# EAGLE design Trig to Gate Converter ctrl V1 (EAGLE 7.7.0)
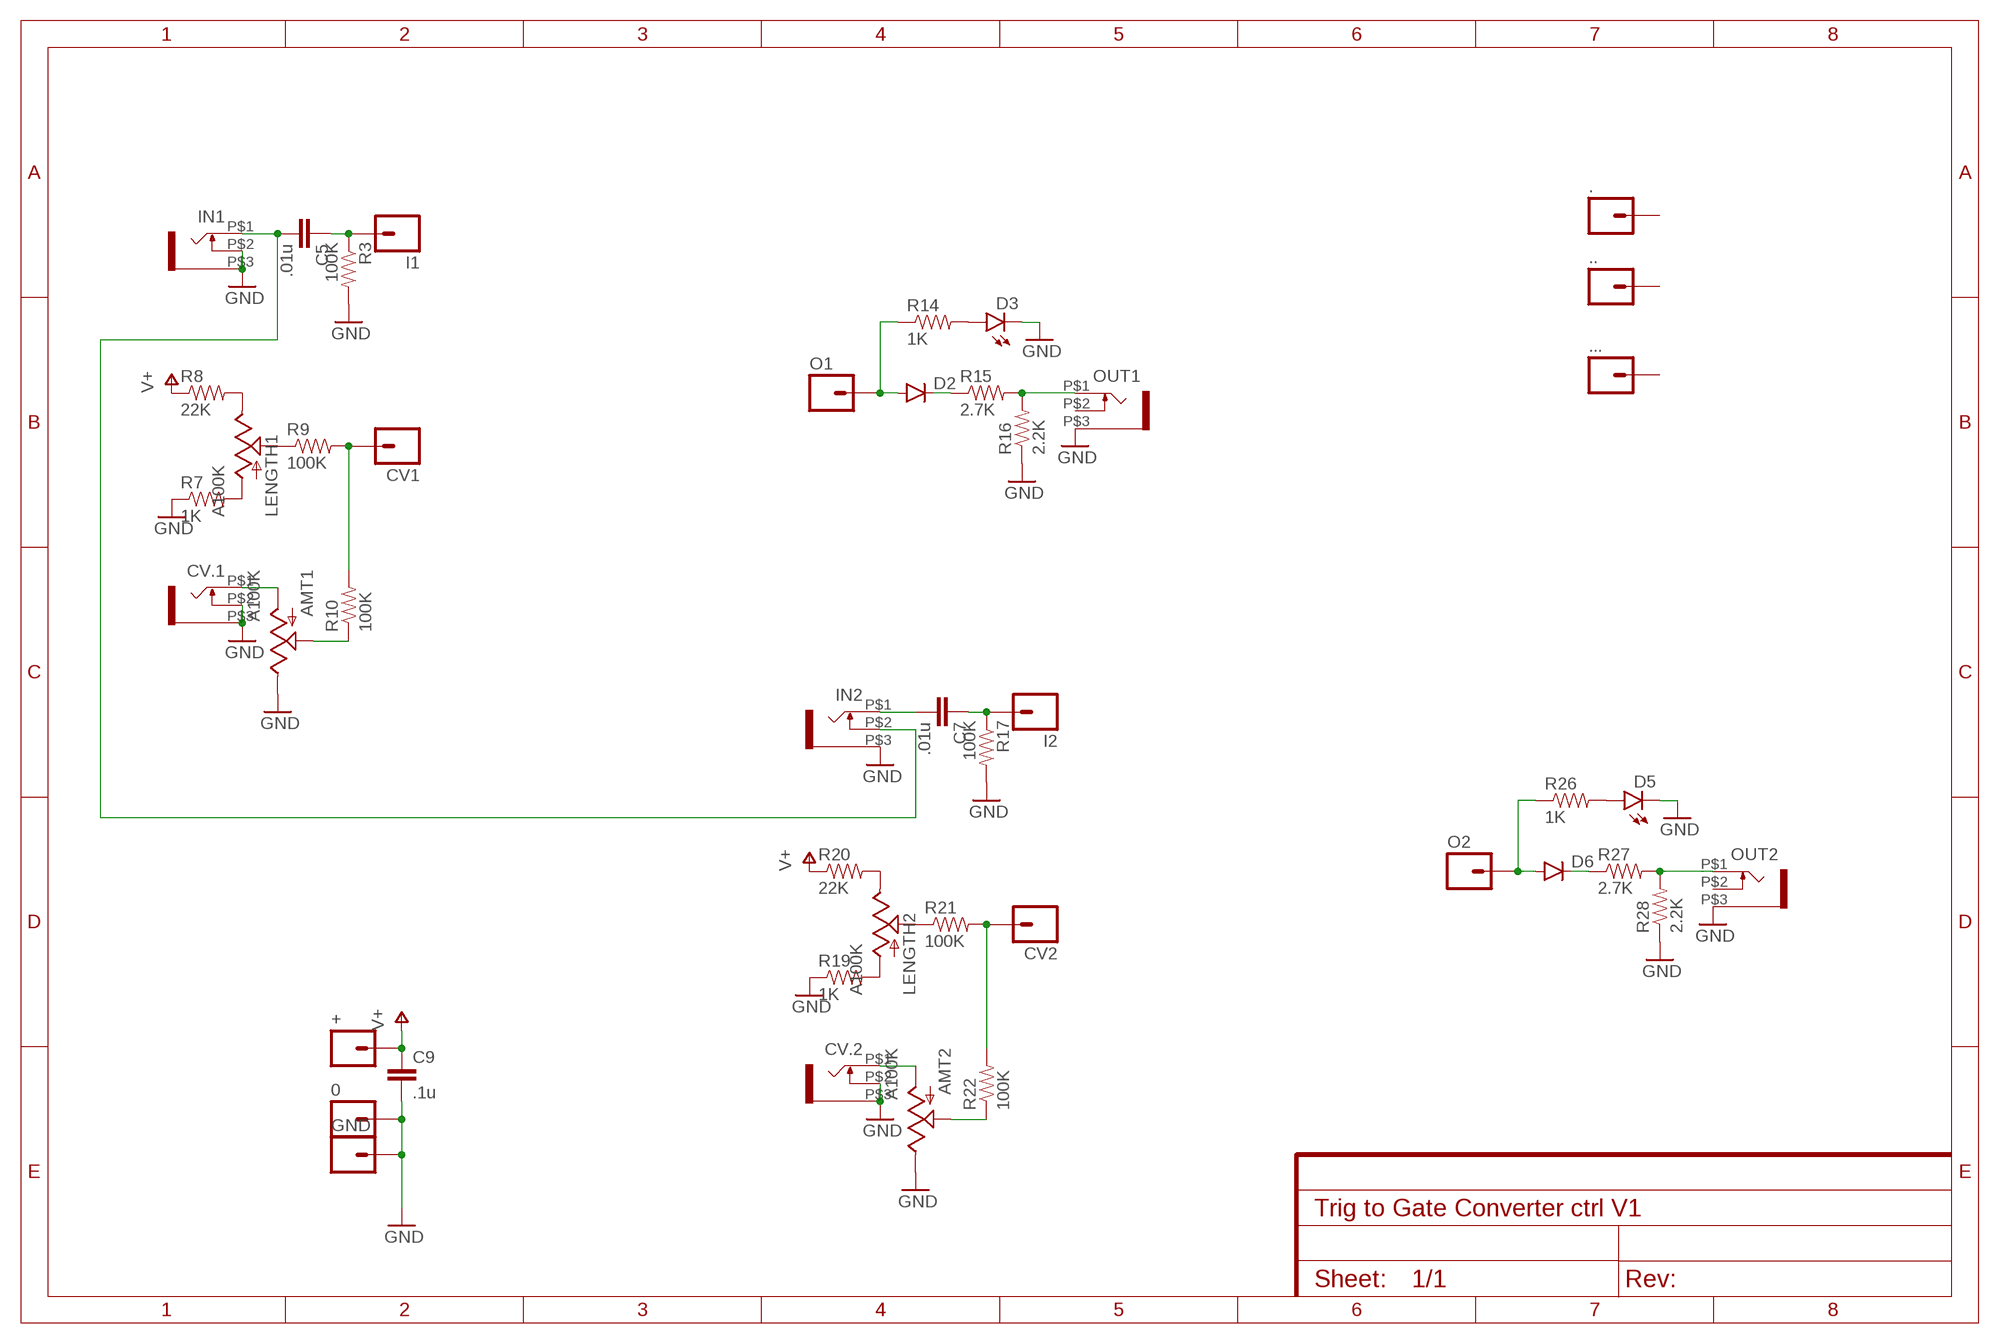
[diagram p0: schematic, sheet 1]

## Parts
0  M01PTH  [1X01]
+  M01PTH  [1X01]
.  M01PTH  [1X01]
..  M01PTH  [1X01]
...  M01PTH  [1X01]
AMT1  A100K  POT  [ALPS_POT]
AMT2  A100K  POT  [ALPS_POT]
C5  .01u  CAP0805  [0805]
C7  .01u  CAP0805  [0805]
C9  .1u  CAP0805  [0805]
CV1  M01PTH  [1X01]
CV2  M01PTH  [1X01]
CV.1  WQP-PJ301M-12_JACK  [WQP-PJ301M-12_JACK]
CV.2  WQP-PJ301M-12_JACK  [WQP-PJ301M-12_JACK]
D2  DIODESOD123  [SOD-123]
D3  LED3MM  [LED3MM]
D5  LED3MM  [LED3MM]
D6  DIODESOD123  [SOD-123]
GND  M01PTH  [1X01]
I1  M01PTH  [1X01]
I2  M01PTH  [1X01]
IN1  WQP-PJ301M-12_JACK  [WQP-PJ301M-12_JACK]
IN2  WQP-PJ301M-12_JACK  [WQP-PJ301M-12_JACK]
LENGTH1  A100K  POT  [ALPS_POT]
LENGTH2  A100K  POT  [ALPS_POT]
O1  M01PTH  [1X01]
O2  M01PTH  [1X01]
OUT1  WQP-PJ301M-12_JACK  [WQP-PJ301M-12_JACK]
OUT2  WQP-PJ301M-12_JACK  [WQP-PJ301M-12_JACK]
R3  100K  RESISTOR0805-RES  [0805]
R7  1K  RESISTOR0805-RES  [0805]
R8  22K  RESISTOR0805-RES  [0805]
R9  100K  RESISTOR0805-RES  [0805]
R10  100K  RESISTOR0805-RES  [0805]
R14  1K  RESISTOR0805-RES  [0805]
R15  2.7K  RESISTOR0805-RES  [0805]
R16  2.2K  RESISTOR0805-RES  [0805]
R17  100K  RESISTOR0805-RES  [0805]
R19  1K  RESISTOR0805-RES  [0805]
R20  22K  RESISTOR0805-RES  [0805]
R21  100K  RESISTOR0805-RES  [0805]
R22  100K  RESISTOR0805-RES  [0805]
R26  1K  RESISTOR0805-RES  [0805]
R27  2.7K  RESISTOR0805-RES  [0805]
R28  2.2K  RESISTOR0805-RES  [0805]

## Nets
GND: 0.1 AMT1.P$1(E) AMT2.P$1(E) C9.2 CV.1.P$2 CV.1.P$3 CV.2.P$2 CV.2.P$3 D3.K(C) D5.K(C) GND.1 IN1.P$2 IN1.P$3 IN2.P$3 OUT1.P$3 OUT2.P$3 R3.2 R7.1 R16.1 R17.2 R19.1 R28.1
N$2: LENGTH2.P$1(E) R20.2
N$4: LENGTH1.P$3(A) R7.2
N$5: LENGTH1.P$1(E) R8.2
N$6: LENGTH1.P$2(S) R9.1
N$7: AMT1.P$3(A) CV.1.P$1
N$8: AMT1.P$2(S) R10.1
N$9: CV1.1 R9.2 R10.2
N$10: C5.2 IN1.P$1 IN2.P$2
N$11: C5.1 I1.1 R3.1
N$14: D3.A R14.2
N$18: OUT1.P$1 R15.2 R16.2
N$19: D2.C R15.1
N$20: D2.A O1.1 R14.1
N$23: LENGTH2.P$3(A) R19.2
N$24: LENGTH2.P$2(S) R21.1
N$25: AMT2.P$3(A) CV.2.P$1
N$26: AMT2.P$2(S) R22.1
N$27: CV2.1 R21.2 R22.2
N$28: C7.2 IN2.P$1
N$29: C7.1 I2.1 R17.1
N$35: D5.A R26.2
N$36: OUT2.P$1 R27.2 R28.2
N$37: D6.C R27.1
N$38: D6.A O2.1 R26.1
V+: +.1 C9.1 R8.1 R20.1
Unconnected: ..1 ...1 ....1 OUT1.P$2 OUT2.P$2

## Library data of the parts
0 + . .. ... CV1 CV2 GND I1 I2 O1 O2 = SparkFun-Connectors:M01: Header 1 Standard 1-pin 0.1" header. Use with straight break away headers (SKU : PRT-00116), right angle break away headers (PRT-00553), swiss pins (PRT-00743), machine pins (PRT-00117), and female headers (PRT-00115).
AMT1 AMT2 LENGTH1 LENGTH2 = SparkFun-Electromechanical:POT; PROD_ID: RES-09177
C5 C7 C9 = SparkFun-Capacitors:CAP: Capacitor Standard 0603 ceramic capacitor, and 0.1" leaded capacitor.
CV.1 CV.2 IN1 IN2 OUT1 OUT2 = thonkiconn:WQP-PJ301M-12_JACK
D2 D6 = SparkFun-DiscreteSemi:DIODE: Diode These are standard reverse protection diodes and small signal diodes. SMA package can handle up to about 1A. SOD-323 can handle about 200mA. What the SOD-323 package when ordering, there are some mfgs out there that are 5-pin packages.
D3 D5 = SparkFun-LED:LED: LEDs Standard schematic elements and footprints for 5mm, 3mm, 1206, and 0603 sized LEDs. 5mm - Spark Fun Electronics SKU : COM-00529 (and others)
R3 R7-R10 R14-R17 R19-R22 R26-R28 = SparkFun-Resistors:RESISTOR: Resistor Basic schematic elements and footprints for 0603, 1206, and PTH resistors.

## Board
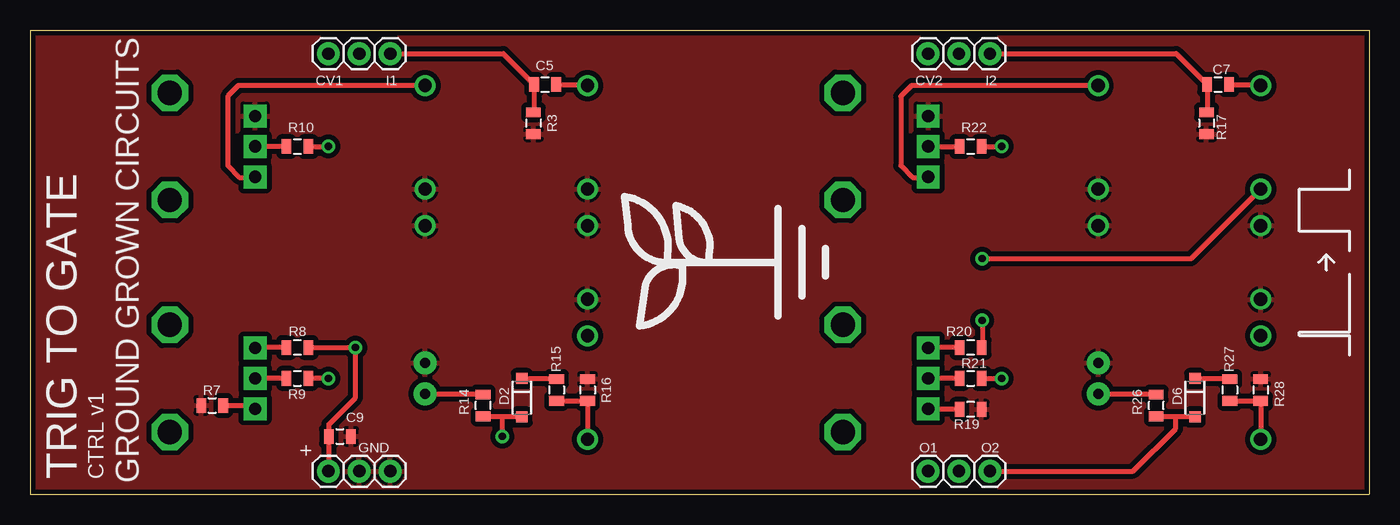
[diagram p1: board, top side]
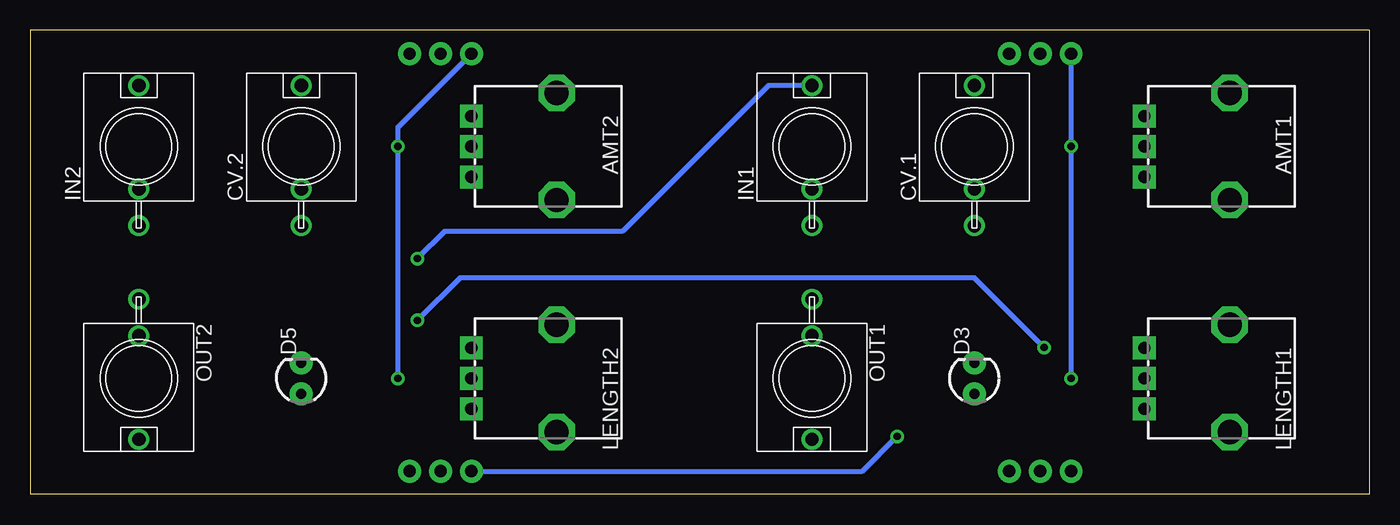
[diagram p2: board, bottom side, seen from below]

Size 109.86 x 38.1 mm. Coordinates in mm from the lower left corner, seen from the top.
Outline: 0,0 109.86,0 109.86,38.1 0,38.1 0,0
Copper layers (1*16): Top 0.035mm / dielectric 1.5mm / Bottom 0.035mm
Design rules "SparkFun": minimum track width 8mil, minimum drill 20mil, track to track 8mil, track to pad 8mil, pad to pad 8mil, via to via 8mil, smd to smd 8mil, copper to edge 8mil, drill to drill 8mil, minimum pad ring 12mil, minimum via ring 10mil, stop-mask expansion 4mil, vias tented up to drill 20mil, thermal gap 10mil

### Footprints (pad centres in the part's own frame; a part is rotated, then mirrored left to right if it is on the bottom)
1X01 = drill 1.016 pad 1.88: 1 0,0
ALPS_POT = drill 1 pad 1.88 square: P$1 7,-2.5; P$2 7,0; P$3 7,2.5 | drill 2 octagon: P$4 0,-4.4; P$5 0,4.4
0805 = smd 0.8 x 1.2: 1 -0.9,0; 2 0.9,0
WQP-PJ301M-12_JACK = drill 1.1: P$1 0,5; P$2 0,-3.5; P$3 0,-6.5
SOD-123 = smd 0.9 x 0.95: A 1.575,0; C -1.575,0
LED3MM = drill 0.813 pad 1.88: A -1.27,0; K 1.27,0

### Placement (x,y rotation side)
0  29.53,1.91 0 top
+  24.45,1.91 90 top
.  26.99,36.2 0 top
..  76.2,36.2 0 top
...  76.2,1.91 0 top
AMT1  11.43,28.57 180 bottom
AMT2  66.67,28.57 180 bottom
C5  42.23,33.66 0 top
C7  97.47,33.66 0 top
C9  25.4,4.76 0 top
CV1  24.45,36.2 0 top
CV2  73.66,36.2 0 top
CV.1  32.38,28.57 0 bottom
CV.2  87.63,28.57 0 bottom
D2  40.32,7.94 270 top
D3  32.38,9.53 90 bottom
D5  87.63,9.53 90 bottom
D6  95.57,7.94 270 top
GND  26.99,1.91 0 top
I1  29.53,36.2 0 top
I2  78.74,36.2 0 top
IN1  45.72,28.57 0 bottom
IN2  100.97,28.57 0 bottom
LENGTH1  11.43,9.53 180 bottom
LENGTH2  66.67,9.53 180 bottom
O1  73.66,1.91 0 top
O2  78.74,1.91 0 top
OUT1  45.72,9.53 180 bottom
OUT2  100.97,9.53 180 bottom
R3  41.27,30.48 270 top
R7  14.92,7.3 0 top
R8  21.91,12.06 180 top
R9  21.91,9.53 0 top
R10  21.91,28.57 0 top
R14  37.15,7.3 90 top
R15  43.18,8.57 270 top
R16  45.72,8.57 270 top
R17  96.52,30.48 270 top
R19  77.15,6.99 180 top
R20  77.15,12.06 180 top
R21  77.15,9.53 0 top
R22  77.15,28.57 0 top
R26  92.39,7.3 90 top
R27  98.42,8.57 270 top
R28  100.97,8.57 270 top
U$1  [LOGO_LARGE]  61.28,19.05 90 top

### Tracks (layer width: path | path; a pad name or v marks a point on that pad's centre or on a via)
GND
  pour Top (isolate 0.406): 0,0 0,38.1 109.86,38.1 109.86,0
N$2
  Top 0.406: R20.2 73.72,12.06 LENGTH2.P$1
N$4
  Top 0.406: R7.2 18.15,7.3 LENGTH1.P$3
N$5
  Top 0.406: R8.2 18.43,12.06 LENGTH1.P$1
N$6
  Top 0.406: R9.1 LENGTH1.P$2
N$7
  Top 0.406: CV.1.P$1 17.07,33.58 16.19,32.7 16.19,26.99 17.14,26.04 18.39,26.04 AMT1.P$3
N$8
  Top 0.406: R10.1 AMT1.P$2
N$9  (via drill 0.6)
  Top 0.406: R10.2 v24.45,28.57 | v24.45,9.53 R9.2
  Bottom 0.406: v24.45,9.53 v24.45,28.57 CV1.1
N$10  (via drill 0.6)
  Top 0.406: C5.2 45.64,33.66 IN1.P$1 | v78.11,19.37 95.26,19.37 IN2.P$2
  Bottom 0.406: IN1.P$1 49.29,33.58 61.28,21.59 75.88,21.59 v78.11,19.37
N$11
  Top 0.406: I1.1 38.79,36.2 C5.1 41.33,31.43 R3.1
N$14
  Top 0.406: R14.2 32.44,8.2 D3.A
N$18
  Top 0.406: R15.2 R16.2 OUT1.P$1
N$19
  Top 0.406: D2.C 43.14,9.51 R15.1
N$20  (via drill 0.6)
  Top 0.406: R14.1 38.73,6.4 | 38.73,6.4 40.28,6.4 D2.A | v38.73,4.76 38.73,6.4
  Bottom 0.406: O1.1 41.59,1.91 v38.73,4.76
N$23
  Top 0.406: R19.2 73.72,6.99 LENGTH2.P$3
N$24
  Top 0.406: R21.1 LENGTH2.P$2
N$25
  Top 0.406: CV.2.P$1 72.31,33.58 71.44,32.7 71.44,26.99 72.39,26.04 73.64,26.04 AMT2.P$3
N$26
  Top 0.406: AMT2.P$2 R22.1
N$27  (via drill 0.6)
  Top 0.406: R21.2 v79.69,9.53 | R22.2 v79.69,28.57
  Bottom 0.406: v79.69,9.53 79.69,28.26 | 79.69,28.26 79.69,30.16 CV2.1 | v79.69,28.57 80.01,28.57 79.69,28.26
N$28
  Top 0.406: C7.2 100.89,33.66 IN2.P$1
N$29
  Top 0.406: I2.1 94.03,36.2 C7.1 96.57,31.43 R17.1
N$35
  Top 0.406: R26.2 87.68,8.2 D5.A
N$36
  Top 0.406: R27.2 R28.2 OUT2.P$1
N$37
  Top 0.406: D6.C 98.39,9.51 R27.1
N$38
  Top 0.406: R26.1 93.98,6.4 | 93.98,6.4 95.53,6.4 D6.A | O2.1 90.49,1.91 93.98,5.4 93.98,6.4
V+  (via drill 0.6)
  Top 0.406: +.1 24.5,1.91 C9.1 24.5,5.77 26.67,7.94 v26.67,12.06 R8.1 | v78.11,14.29 78.11,12.12 R20.1
  Bottom 0.406: v26.67,12.06 32.38,17.78 74.61,17.78 v78.11,14.29

### Text on the board
tPlace: TRIG TO GATE | CTRL v1 | GROUND GROWN CIRCUITS